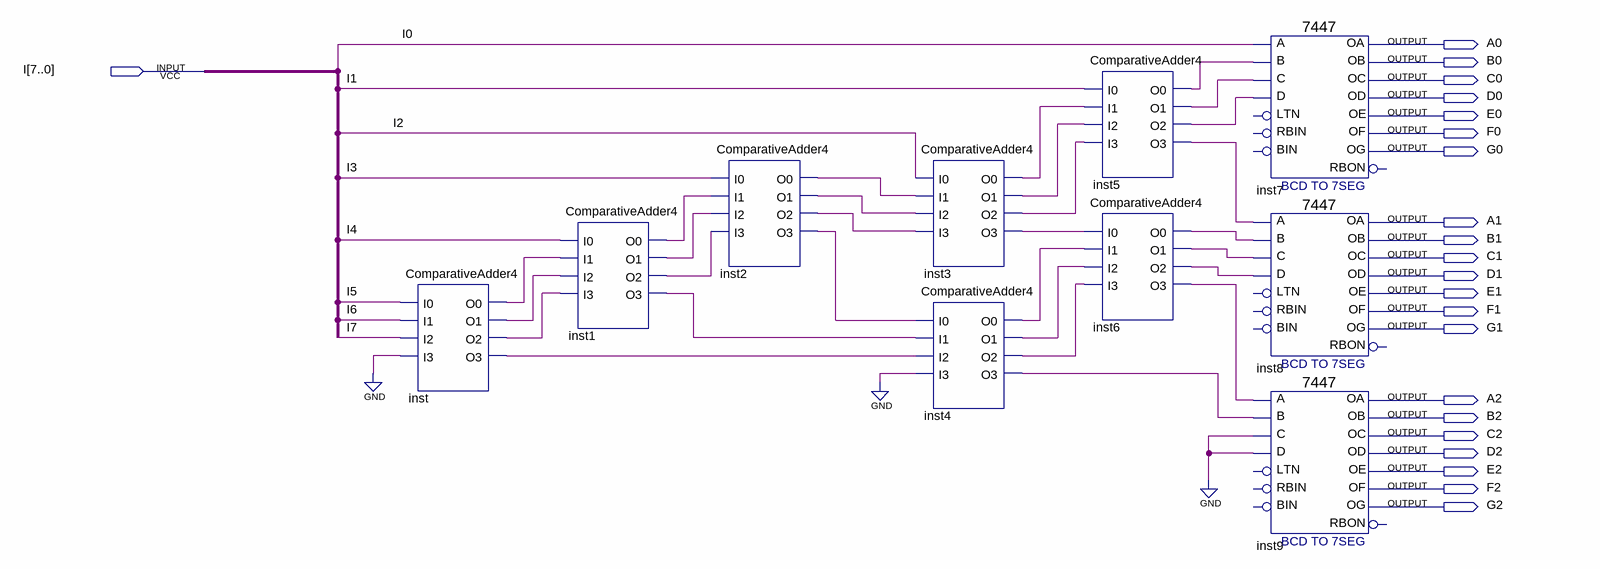
[diagram p0: schematic sheet]
// Quartus schematic DD8.bdf as structural Verilog: 10 symbols, 22 pins
module DD8 (
  input  [7:0] I,
  output A0,
  output B0,
  output C0,
  output D0,
  output E0,
  output F0,
  output G0,
  output A1,
  output B1,
  output C1,
  output D1,
  output E1,
  output F1,
  output G1,
  output A2,
  output B2,
  output C2,
  output D2,
  output E2,
  output F2,
  output G2
);

  wire inst1_o0, inst1_o1, inst1_o2, inst1_o3, inst2_o0, inst2_o1, inst2_o2, inst2_o3, inst3_o0, inst3_o1,
       inst3_o2, inst3_o3, inst4_o0, inst4_o1, inst4_o2, inst4_o3, inst5_o0, inst5_o1, inst5_o2, inst5_o3,
       inst6_o0, inst6_o1, inst6_o2, inst6_o3, inst_o0, inst_o1, inst_o2, inst_o3;

  ComparativeAdder4 inst (
    .I0(I[5]), .I1(I[6]), .I2(I[7]), .I3(1'b0), .O0(inst_o0), .O1(inst_o1), .O2(inst_o2), .O3(inst_o3));
  ComparativeAdder4 inst1 (
    .I0(I[4]), .I1(inst_o0), .I2(inst_o1), .I3(inst_o2), .O0(inst1_o0), .O1(inst1_o1), .O2(inst1_o2),
    .O3(inst1_o3));
  ComparativeAdder4 inst2 (
    .I0(I[3]), .I1(inst1_o0), .I2(inst1_o1), .I3(inst1_o2), .O0(inst2_o0), .O1(inst2_o1), .O2(inst2_o2),
    .O3(inst2_o3));
  ComparativeAdder4 inst3 (
    .I0(I[2]), .I1(inst2_o0), .I2(inst2_o1), .I3(inst2_o2), .O0(inst3_o0), .O1(inst3_o1), .O2(inst3_o2),
    .O3(inst3_o3));
  ComparativeAdder4 inst4 (
    .I0(inst2_o3), .I1(inst1_o3), .I2(inst_o3), .I3(1'b0), .O0(inst4_o0), .O1(inst4_o1), .O2(inst4_o2),
    .O3(inst4_o3));
  ComparativeAdder4 inst5 (
    .I0(I[1]), .I1(inst3_o0), .I2(inst3_o1), .I3(inst3_o2), .O0(inst5_o0), .O1(inst5_o1), .O2(inst5_o2),
    .O3(inst5_o3));
  ComparativeAdder4 inst6 (
    .I0(inst3_o3), .I1(inst4_o0), .I2(inst4_o1), .I3(inst4_o2), .O0(inst6_o0), .O1(inst6_o1), .O2(inst6_o2),
    .O3(inst6_o3));
  \7447  inst7 (
    .B(inst5_o0), .C(inst5_o1), .D(inst5_o2), .A(I[0]), .OB(B0), .OC(C0), .OE(E0), .OD(D0), .OF(F0), .OG(G0),
    .OA(A0));  // open: LTN, RBIN, BIN, RBON
  \7447  inst8 (
    .B(inst6_o0), .C(inst6_o1), .D(inst6_o2), .A(inst5_o3), .OB(B1), .OC(C1), .OE(E1), .OD(D1), .OF(F1),
    .OG(G1), .OA(A1));  // open: LTN, RBIN, BIN, RBON
  \7447  inst9 (
    .B(inst4_o3), .C(1'b0), .D(1'b0), .A(inst6_o3), .OB(B2), .OC(C2), .OE(E2), .OD(D2), .OF(F2), .OG(G2),
    .OA(A2));  // open: LTN, RBIN, BIN, RBON
endmodule
